# EAGLE schematic improved sample-and-hold-cpy (EAGLE 7.2.0)
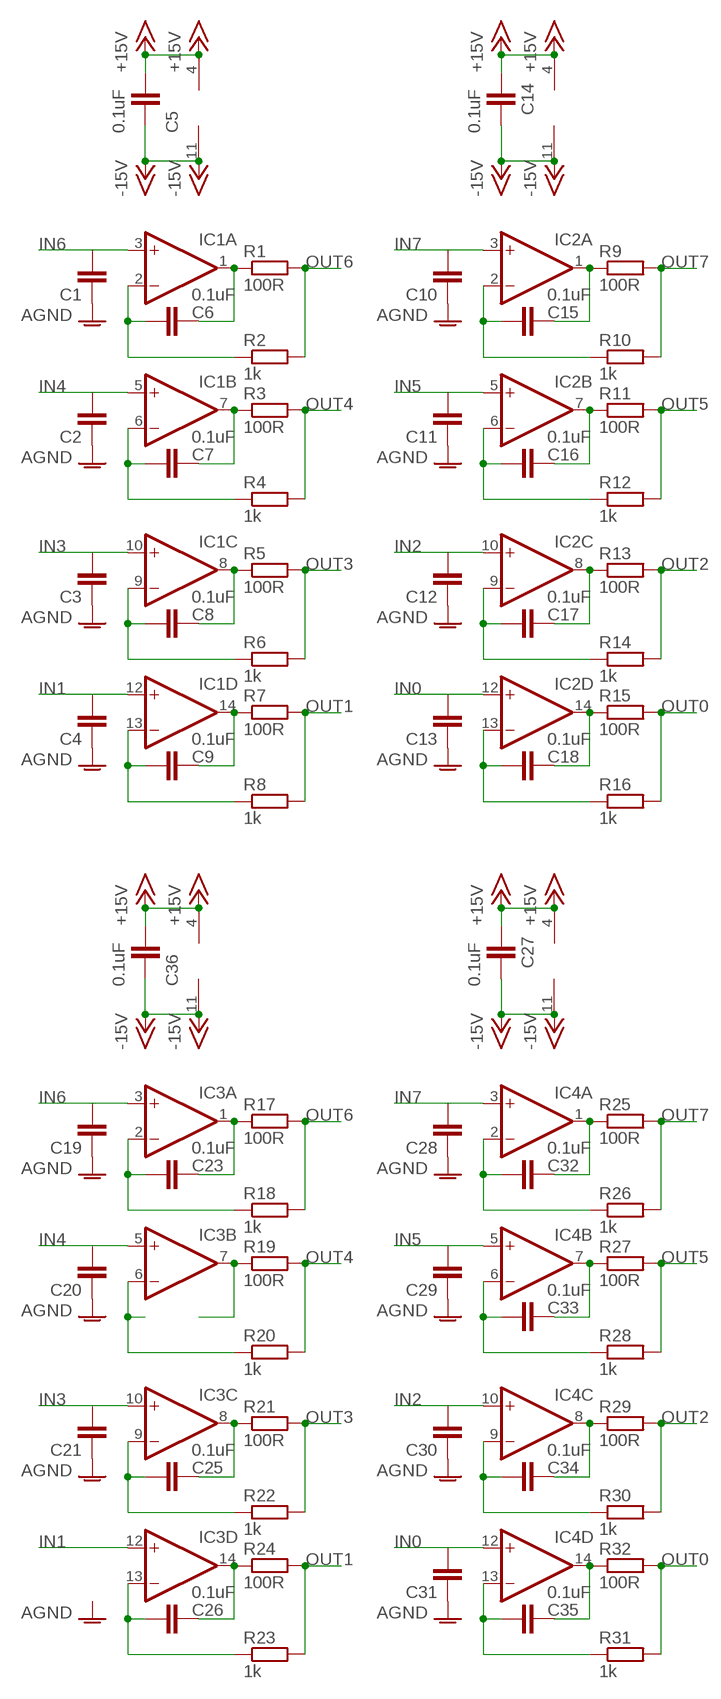
[diagram p0: schematic, sheet 1]

## Parts
C1  C-EUC1206  [C1206]
C2  C-EUC1206  [C1206]
C3  C-EUC1206  [C1206]
C4  C-EUC1206  [C1206]
C5  0.1uF  C-EUC0603  [C0603]
C6  0.1uF  C-EUC0603  [C0603]
C7  0.1uF  C-EUC0603  [C0603]
C8  0.1uF  C-EUC0603  [C0603]
C9  0.1uF  C-EUC0603  [C0603]
C10  C-EUC1206  [C1206]
C11  C-EUC1206  [C1206]
C12  C-EUC1206  [C1206]
C13  C-EUC1206  [C1206]
C14  0.1uF  C-EUC0603  [C0603]
C15  0.1uF  C-EUC0603  [C0603]
C16  0.1uF  C-EUC0603  [C0603]
C17  0.1uF  C-EUC0603  [C0603]
C18  0.1uF  C-EUC0603  [C0603]
C19  C-EUC1206  [C1206]
C20  C-EUC1206  [C1206]
C21  C-EUC1206  [C1206]
C23  0.1uF  C-EUC0603  [C0603]
C25  0.1uF  C-EUC0603  [C0603]
C26  0.1uF  C-EUC0603  [C0603]
C27  0.1uF  C-EUC0603  [C0603]
C28  C-EUC1206  [C1206]
C29  C-EUC1206  [C1206]
C30  C-EUC1206  [C1206]
C31  C-EUC1206  [C1206]
C32  0.1uF  C-EUC0603  [C0603]
C33  0.1uF  C-EUC0603  [C0603]
C34  0.1uF  C-EUC0603  [C0603]
C35  0.1uF  C-EUC0603  [C0603]
C36  0.1uF  C-EUC0603  [C0603]
IC1  TL074D  [SO14]
IC2  TL074D  [SO14]
IC3  TL074D  [SO14]
IC4  TL074D  [SO14]
R1  100R  R-EU_R0603  [R0603]
R2  1k  R-EU_R0603  [R0603]
R3  100R  R-EU_R0603  [R0603]
R4  1k  R-EU_R0603  [R0603]
R5  100R  R-EU_R0603  [R0603]
R6  1k  R-EU_R0603  [R0603]
R7  100R  R-EU_R0603  [R0603]
R8  1k  R-EU_R0603  [R0603]
R9  100R  R-EU_R0603  [R0603]
R10  1k  R-EU_R0603  [R0603]
R11  100R  R-EU_R0603  [R0603]
R12  1k  R-EU_R0603  [R0603]
R13  100R  R-EU_R0603  [R0603]
R14  1k  R-EU_R0603  [R0603]
R15  100R  R-EU_R0603  [R0603]
R16  1k  R-EU_R0603  [R0603]
R17  100R  R-EU_R0603  [R0603]
R18  1k  R-EU_R0603  [R0603]
R19  100R  R-EU_R0603  [R0603]
R20  1k  R-EU_R0603  [R0603]
R21  100R  R-EU_R0603  [R0603]
R22  1k  R-EU_R0603  [R0603]
R23  1k  R-EU_R0603  [R0603]
R24  100R  R-EU_R0603  [R0603]
R25  100R  R-EU_R0603  [R0603]
R26  1k  R-EU_R0603  [R0603]
R27  100R  R-EU_R0603  [R0603]
R28  1k  R-EU_R0603  [R0603]
R29  100R  R-EU_R0603  [R0603]
R30  1k  R-EU_R0603  [R0603]
R31  1k  R-EU_R0603  [R0603]
R32  100R  R-EU_R0603  [R0603]

## Nets
+15V: C5.1 C14.1 C27.1 C36.1 IC1.4(P:V+) IC2.4(P:V+) IC3.4(P:V+) IC4.4(P:V+)
-15V: C5.2 C14.2 C27.2 C36.2 IC1.11(P:V-) IC2.11(P:V-) IC3.11(P:V-) IC4.11(P:V-)
AGND: C1.1 C2.1 C3.1 C4.1 C10.1 C11.1 C12.1 C13.1 C19.1 C20.1 C21.1 C28.1 C29.1 C30.1 C31.1
IN0: C13.2 C31.2 IC2.12(D:+IN) IC4.12(D:+IN)
IN1: C4.2 IC1.12(D:+IN) IC3.12(D:+IN)
IN2: C12.2 C30.2 IC2.10(C:+IN) IC4.10(C:+IN)
IN3: C3.2 C21.2 IC1.10(C:+IN) IC3.10(C:+IN)
IN4: C2.2 C20.2 IC1.5(B:+IN) IC3.5(B:+IN)
IN5: C11.2 C29.2 IC2.5(B:+IN) IC4.5(B:+IN)
IN6: C1.2 C19.2 IC1.3(A:+IN) IC3.3(A:+IN)
IN7: C10.2 C28.2 IC2.3(A:+IN) IC4.3(A:+IN)
N$1: C6.2 IC1.2(A:-IN) R2.1
N$2: C6.1 IC1.1(A:OUT) R1.1
N$3: C7.1 IC1.7(B:OUT) R3.1
N$4: C8.1 IC1.8(C:OUT) R5.1
N$5: C7.2 IC1.6(B:-IN) R4.1
N$6: C9.1 IC1.14(D:OUT) R7.1
N$7: C8.2 IC1.9(C:-IN) R6.1
N$8: C9.2 IC1.13(D:-IN) R8.1
N$9: C23.1 IC3.1(A:OUT) R17.1
N$10: C23.2 IC3.2(A:-IN) R18.1
N$11: C15.1 IC2.1(A:OUT) R9.1
N$12: C15.2 IC2.2(A:-IN) R10.1
N$13: C16.1 IC2.7(B:OUT) R11.1
N$14: C16.2 IC2.6(B:-IN) R12.1
N$15: C17.1 IC2.8(C:OUT) R13.1
N$16: C18.1 IC2.14(D:OUT) R15.1
N$17: C17.2 IC2.9(C:-IN) R14.1
N$18: C18.2 IC2.13(D:-IN) R16.1
N$19: IC3.7(B:OUT) R19.1
N$20: IC3.6(B:-IN) R20.1
N$21: C25.1 IC3.8(C:OUT) R21.1
N$22: C26.1 IC3.14(D:OUT) R24.1
N$23: C25.2 IC3.9(C:-IN) R22.1
N$24: C26.2 IC3.13(D:-IN) R23.1
N$25: C32.1 IC4.1(A:OUT) R25.1
N$26: C32.2 IC4.2(A:-IN) R26.1
N$27: C33.1 IC4.7(B:OUT) R27.1
N$28: C33.2 IC4.6(B:-IN) R28.1
N$29: C34.1 IC4.8(C:OUT) R29.1
N$30: C35.1 IC4.14(D:OUT) R32.1
N$31: C34.2 IC4.9(C:-IN) R30.1
N$32: C35.2 IC4.13(D:-IN) R31.1
OUT0: R15.2 R16.2 R31.2 R32.2
OUT1: R7.2 R8.2 R23.2 R24.2
OUT2: R13.2 R14.2 R29.2 R30.2
OUT3: R5.2 R6.2 R21.2 R22.2
OUT4: R3.2 R4.2 R19.2 R20.2
OUT5: R11.2 R12.2 R27.2 R28.2
OUT6: R1.2 R2.2 R17.2 R18.2
OUT7: R9.2 R10.2 R25.2 R26.2

## Library data of the parts
C1-C21 C23 C25-C36 = resistor:C-EU: CAPACITOR, European symbol
IC1-IC4 = linear:TL074: OP AMP
R1-R32 = resistor:R-EU_: RESISTOR, European symbol